# EAGLE design easyampl (EAGLE 5.08)
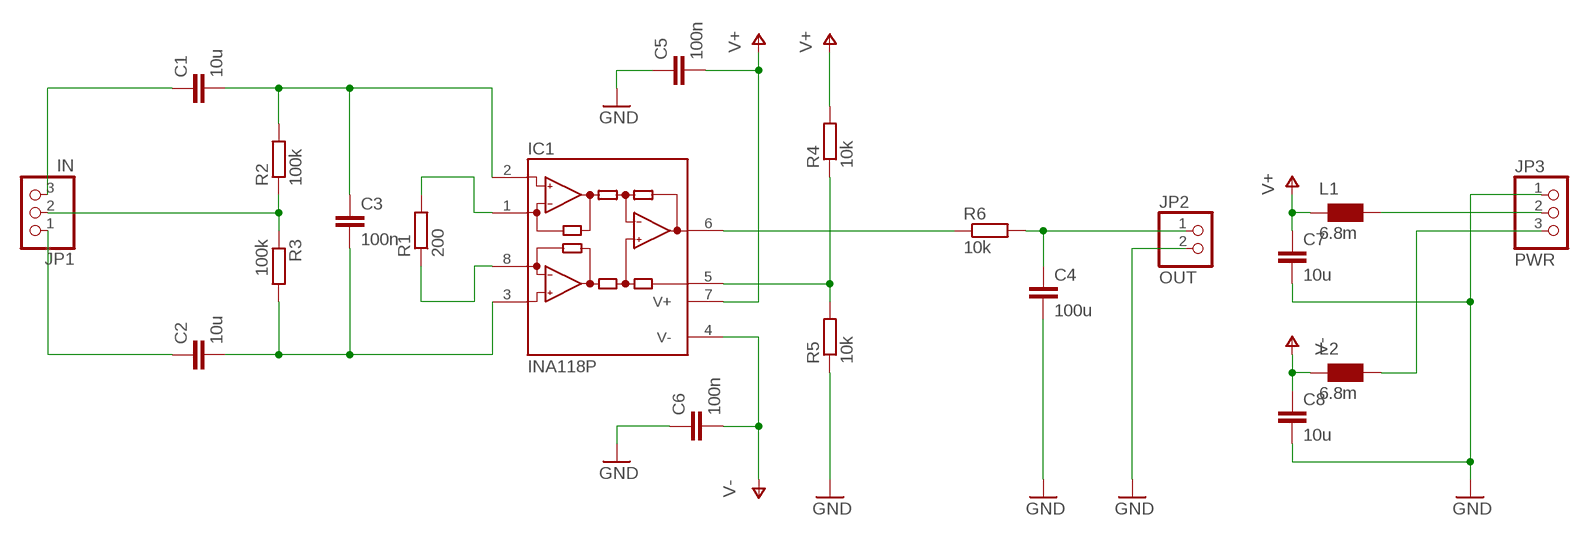
[diagram p0: schematic, sheet 1]

## Parts
C1  10u  C-EU050-055X075  [C050-055X075]
C2  10u  C-EU050-055X075  [C050-055X075]
C3  100n  C-EU050-055X075  [C050-055X075]
C4  100u  C-EU050-055X075  [C050-055X075]
C5  100n  C-EUC1206  [C1206]
C6  100n  C-EUC1206  [C1206]
C7  10u  C-EUC0805K  [C0805K]
C8  10u  C-EUC0805K  [C0805K]
IC1  INA118P  [DIL08]
JP1  IN  PINHD-1X3  [1X03]
JP2  OUT  PINHD-1X2  [1X02]
JP3  PWR  PINHD-1X3  [1X03]
L1  6.8m  WE-PD4_L  [L]
L2  6.8m  WE-PD4_L  [L]
R1  200  R-EU_0207/12  [0207/12]
R2  100k  R-EU_0207/12  [0207/12]
R3  100k  R-EU_0207/12  [0207/12]
R4  10k  R-EU_0207/12  [0207/12]
R5  10k  R-EU_0207/12  [0207/12]
R6  10k  R-EU_0207/15  [0207/15]

## Nets
GND: C4.2 C5.1 C6.1 C7.2 C8.2 JP2.2 JP3.1 R5.1
N$1: IC1.1(RG) R1.2
N$2: IC1.8(RG) R1.1
N$3: C1.2 C3.1 IC1.2(-IN) R2.2
N$4: C2.2 C3.2 IC1.3(+IN) R3.2
N$5: C1.1 JP1.3
N$6: C2.1 JP1.1
N$8: JP1.2 R2.1 R3.1
N$10: IC1.5(REF) R4.1 R5.2
N$13: IC1.6(OUT) R6.1
N$14: C4.1 JP2.1 R6.2
N$17: JP3.2 L1.1
N$19: JP3.3 L2.1
V+: C5.2 C7.1 IC1.7(V+) L1.2 R4.2
V-: C6.2 C8.1 IC1.4(V-) L2.2

## Library data of the parts
C1-C8 = rcl:C-EU: CAPACITOR, European symbol
IC1 = OU:INA118: Instrumentation Amplifier Precision, Low Power
JP1 JP3 = pinhead:PINHD-1X3: PIN HEADER
JP2 = pinhead:PINHD-1X2: PIN HEADER
L1 L2 = wuerth-elektronik:WE-PD4: SMD-Power Inductors WE-PD4 Is recommended for the application with switching regulators from National Semiconductor, Linear Technology, Texas Instruments and Fairchild Semiconductor - Current loading up to 35 A - Compact size - Low-loss ferrite core - High storage capacity
R1-R3 = resistor:R-EU_: RESISTOR, European symbol
R4-R6 = rcl:R-EU_: RESISTOR, European symbol

## Board
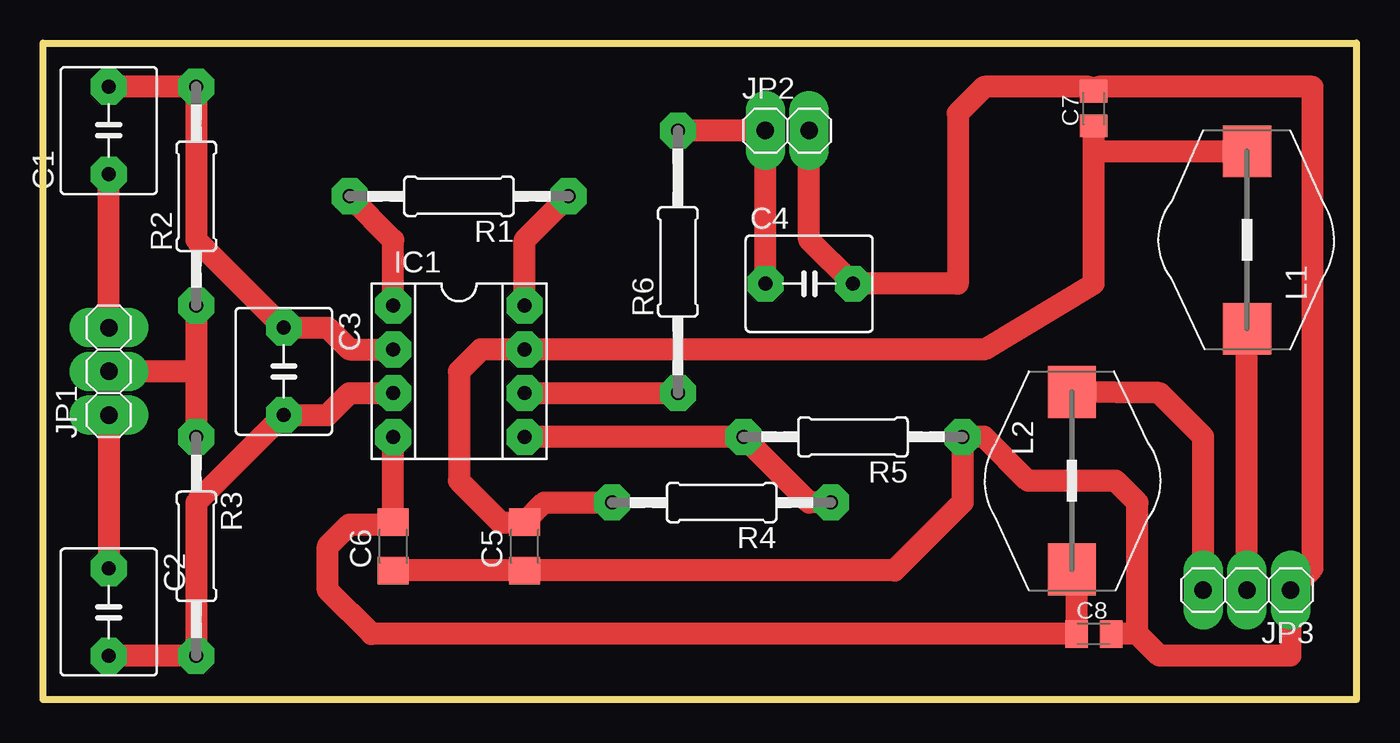
[diagram p1: board, top side]

Size 76.2 x 38.1 mm. Coordinates in mm from the lower left corner, seen from the top.
Outline: 76.2,0 0,0 0,38.1 76.2,38.1 76.2,0
Copper layers (1*16): Top 0.035mm / dielectric 1.5mm / Bottom 0.035mm
Design rules "default": minimum track width 16mil, minimum drill 32mil, track to track 16mil, track to pad 16mil, pad to pad 16mil, via to via 16mil, smd to smd 16mil, copper to edge 40mil, drill to drill 40mil, minimum pad ring 25mil, minimum via ring 12mil, stop-mask expansion 4mil, vias tented up to drill 0mil, thermal gap 10mil

### Footprints (pad centres in the part's own frame; a part is rotated, then mirrored left to right if it is on the bottom)
C050-055X075 = drill 0.813 octagon: 1 -2.54,0; 2 2.54,0
C1206 = smd 1.6 x 1.8: 1 -1.4,0; 2 1.4,0
C0805K = smd 1.3 x 1.6: 1 -1,0; 2 1,0
DIL08 = drill 0.813 pad 1.6 octagon: 1 -3.81,-3.81; 2 -1.27,-3.81; 3 1.27,-3.81; 4 3.81,-3.81; 5 3.81,3.81; 6 1.27,3.81; 7 -1.27,3.81; 8 -3.81,3.81
1X03 = drill 1.016 long: 1 -2.54,0; 2 0,0; 3 2.54,0
1X02 = drill 1.016 long: 1 -1.27,0; 2 1.27,0
L = smd 3 x 2.8: 1 -5.15,0; 2 5.15,0
0207/12 = drill 0.813 octagon: 1 -6.35,0; 2 6.35,0
0207/15 = drill 0.813 octagon: 1 -7.62,0; 2 7.62,0

### Placement (x,y rotation side)
C1  3.81,33.02 90 top
C2  3.81,5.08 270 top
C3  13.97,19.05 270 top
C4  44.45,24.13 0 top
C5  27.94,8.89 90 top
C6  20.32,8.89 90 top
C7  60.96,34.29 90 top
C8  60.96,3.81 0 top
IC1  24.13,19.05 270 top
JP1  3.81,19.05 90 top
JP2  43.18,33.02 0 top
JP3  69.85,6.35 180 top
L1  69.85,26.67 90 top
L2  59.69,12.7 270 top
R1  24.13,29.21 180 top
R2  8.89,29.21 90 top
R3  8.89,8.89 270 top
R4  39.37,11.43 180 top
R5  46.99,15.24 180 top
R6  36.83,25.4 90 top

### Tracks (layer width: path | path; a pad name or v marks a point on that pad's centre or on a via)
GND
  Top 1.27: JP2.2 44.45,26.67 C4.2 53.07,24.13 53.07,34.02 54.61,35.56 60.69,35.56 C7.2 61.23,35.56 73.66,35.56 73.66,7.62 JP3.1 72.39,2.54 64.77,2.54 63.5,3.81 | C6.1 C5.1 49.4,7.49 53.34,11.43 R5.1 54.61,15.24 57.15,12.7 62.23,12.7 63.5,11.43 63.5,3.81 | 63.5,3.81 C8.2
N$1
  Top 1.27: IC1.1 20.32,26.67 R1.2
N$2
  Top 1.27: IC1.8 27.94,26.67 R1.1
N$3
  Top 1.27: C1.2 R2.2 8.89,26.67 C3.1 16.51,21.59 17.78,20.32 IC1.2
N$4
  Top 1.27: C2.2 R3.2 8.89,11.43 C3.2 16.51,16.51 17.78,17.78 IC1.3
N$5
  Top 1.27: JP1.3 C1.1
N$6
  Top 1.27: JP1.1 C2.1
N$8
  Top 1.27: R2.1 8.89,19.05 | 8.89,19.05 JP1.2 | 8.89,19.05 R3.1
N$10
  Top 1.27: IC1.5 R5.2 44.45,11.43 R4.1
N$13
  Top 1.27: IC1.6 R6.1
N$14
  Top 1.27: R6.2 JP2.1 C4.1
N$17
  Top 1.27: JP3.2 L1.1
N$19
  Top 1.27: L2.1 64.77,17.78 67.31,15.24 JP3.3
V+
  Top 1.27: C5.2 26.54,10.29 24.13,12.7 24.13,19.05 25.4,20.32 IC1.7 54.61,20.32 60.96,24.13 60.96,31.75 | C5.2 28.07,10.16 | R4.2 29.08,11.43 C5.2 | 60.96,31.75 C7.1 | L1.2 61.03,31.82 60.96,31.75
V-
  Top 1.27: IC1.4 C6.2 20.19,10.16 17.78,10.16 16.51,8.89 16.51,6.35 19.05,3.81 C8.1 59.96,7.28 L2.2